# EAGLE schematic nobrain_v0.2 (EAGLE 4.16)
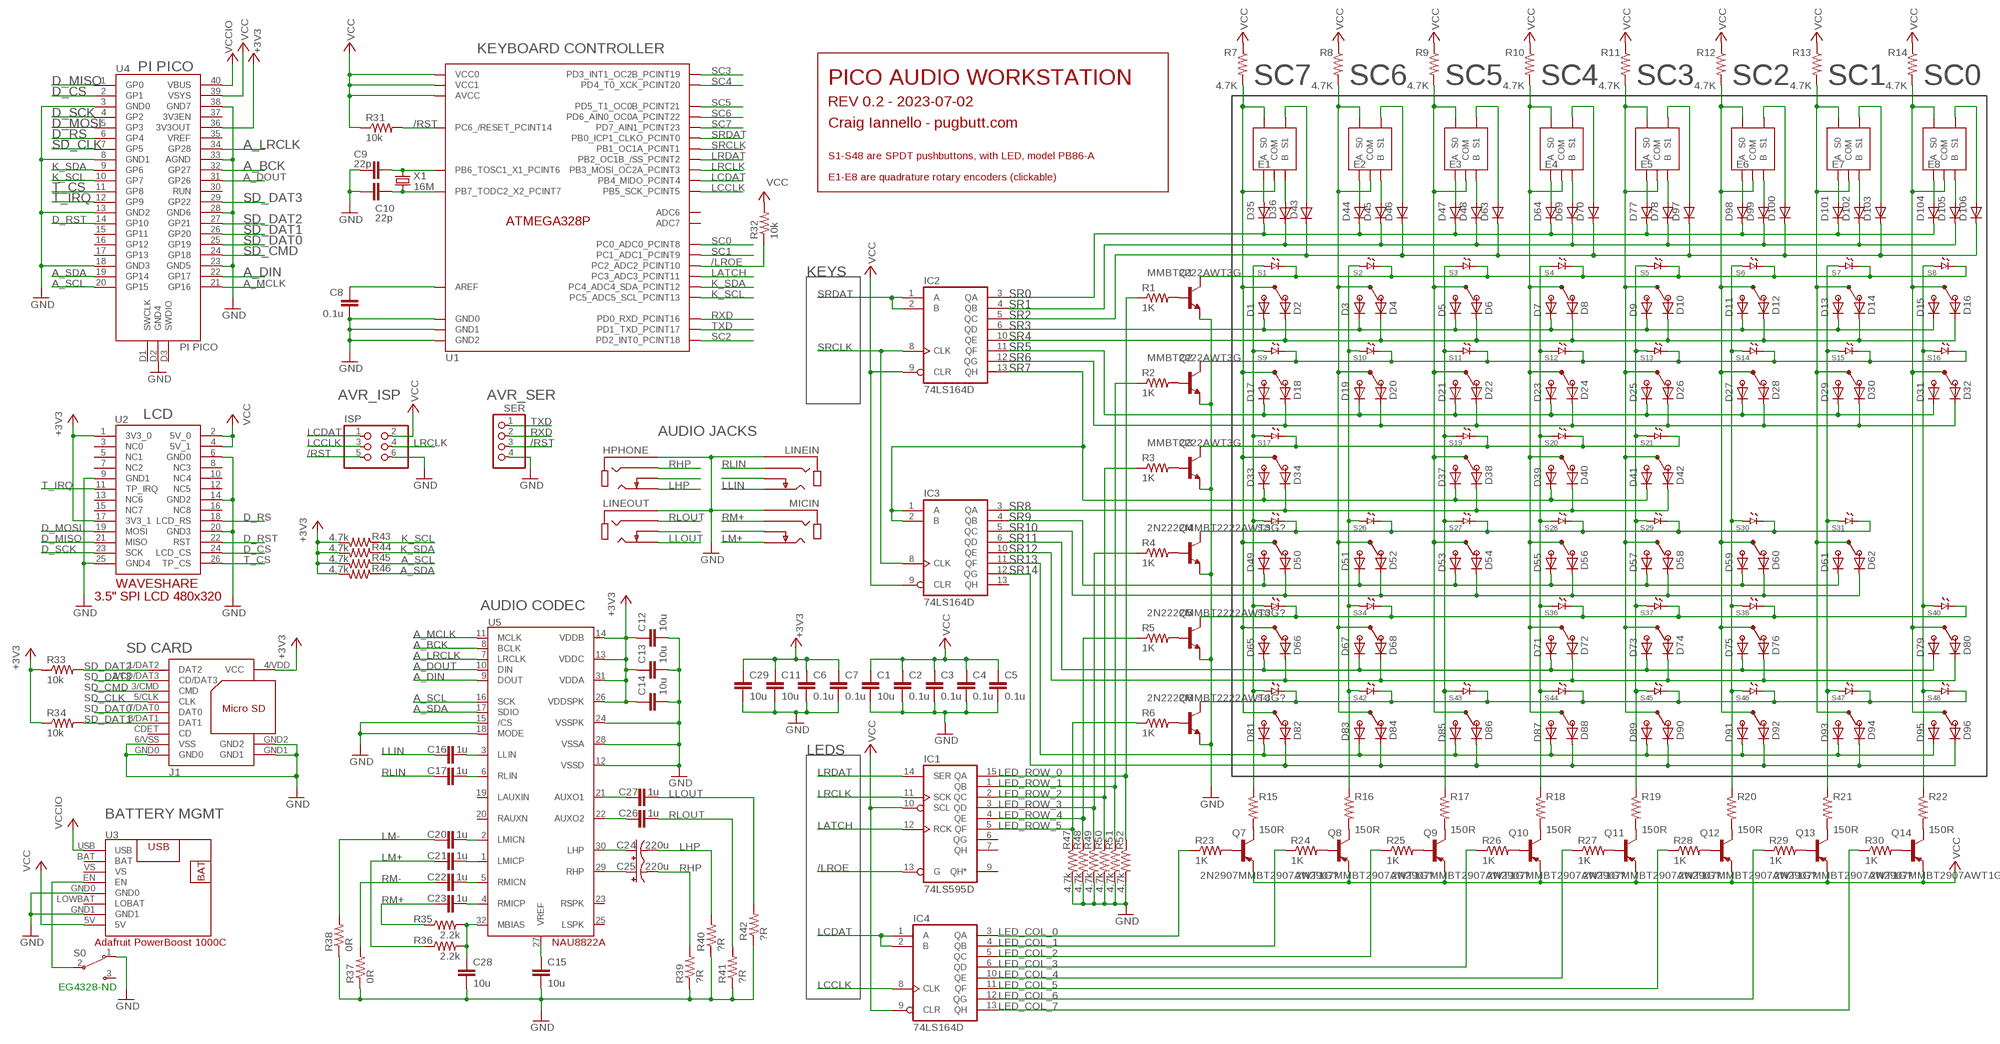
[diagram p0: schematic, sheet 1]

## Parts
C1  10u  C-EU_0805  [0805]
C2  0.1u  C-EU_0603  [0603]
C3  0.1u  C-EU_0603  [0603]
C4  0.1u  C-EU_0603  [0603]
C5  0.1u  C-EU_0603  [0603]
C6  0.1u  C-EU_0603  [0603]
C7  0.1u  C-EU_0603  [0603]
C8  0.1u  C-EU_0603  [0603]
C9  22p  C-EU_0603  [0603]
C10  22p  C-EU_0603  [0603]
C11  10u  C-EU_0805  [0805]
C12  10u  C-EU_0805  [0805]
C13  10u  C-EU_0805  [0805]
C14  10u  C-EU_0805  [0805]
C15  10u  C-EU_0805  [0805]
C16  1u  C-EU_0603  [0603]
C17  1u  C-EU_0603  [0603]
C20  1u  C-EU_0603  [0603]
C21  1u  C-EU_0603  [0603]
C22  1u  C-EU_0603  [0603]
C23  1u  C-EU_0603  [0603]
C24  220u  CPOL-US150CLZ-0810  [150CLZ-0810]
C25  220u  CPOL-US150CLZ-0810  [150CLZ-0810]
C26  1u  C-EU_0603  [0603]
C27  1u  C-EU_0603  [0603]
C28  10u  C-EU_0805  [0805]
C29  10u  C-EU_0805  [0805]
D1  DIODE-SOD323-R  [SOD323-R]
D2  DIODE-SOD323-R  [SOD323-R]
D3  DIODE-SOD323-R  [SOD323-R]
D4  DIODE-SOD323-R  [SOD323-R]
D5  DIODE-SOD323-R  [SOD323-R]
D6  DIODE-SOD323-R  [SOD323-R]
D7  DIODE-SOD323-R  [SOD323-R]
D8  DIODE-SOD323-R  [SOD323-R]
D9  DIODE-SOD323-R  [SOD323-R]
D10  DIODE-SOD323-R  [SOD323-R]
D11  DIODE-SOD323-R  [SOD323-R]
D12  DIODE-SOD323-R  [SOD323-R]
D13  DIODE-SOD323-R  [SOD323-R]
D14  DIODE-SOD323-R  [SOD323-R]
D15  DIODE-SOD323-R  [SOD323-R]
D16  DIODE-SOD323-R  [SOD323-R]
D17  DIODE-SOD323-R  [SOD323-R]
D18  DIODE-SOD323-R  [SOD323-R]
D19  DIODE-SOD323-R  [SOD323-R]
D20  DIODE-SOD323-R  [SOD323-R]
D21  DIODE-SOD323-R  [SOD323-R]
D22  DIODE-SOD323-R  [SOD323-R]
D23  DIODE-SOD323-R  [SOD323-R]
D24  DIODE-SOD323-R  [SOD323-R]
D25  DIODE-SOD323-R  [SOD323-R]
D26  DIODE-SOD323-R  [SOD323-R]
D27  DIODE-SOD323-R  [SOD323-R]
D28  DIODE-SOD323-R  [SOD323-R]
D29  DIODE-SOD323-R  [SOD323-R]
D30  DIODE-SOD323-R  [SOD323-R]
D31  DIODE-SOD323-R  [SOD323-R]
D32  DIODE-SOD323-R  [SOD323-R]
D33  DIODE-SOD323-R  [SOD323-R]
D34  DIODE-SOD323-R  [SOD323-R]
D35  DIODE-SOD323-R  [SOD323-R]
D36  DIODE-SOD323-R  [SOD323-R]
D37  DIODE-SOD323-R  [SOD323-R]
D38  DIODE-SOD323-R  [SOD323-R]
D39  DIODE-SOD323-R  [SOD323-R]
D40  DIODE-SOD323-R  [SOD323-R]
D41  DIODE-SOD323-R  [SOD323-R]
D42  DIODE-SOD323-R  [SOD323-R]
D43  DIODE-SOD323-R  [SOD323-R]
D44  DIODE-SOD323-R  [SOD323-R]
D45  DIODE-SOD323-R  [SOD323-R]
D46  DIODE-SOD323-R  [SOD323-R]
D47  DIODE-SOD323-R  [SOD323-R]
D48  DIODE-SOD323-R  [SOD323-R]
D49  DIODE-SOD323-R  [SOD323-R]
D50  DIODE-SOD323-R  [SOD323-R]
D51  DIODE-SOD323-R  [SOD323-R]
D52  DIODE-SOD323-R  [SOD323-R]
D53  DIODE-SOD323-R  [SOD323-R]
D54  DIODE-SOD323-R  [SOD323-R]
D55  DIODE-SOD323-R  [SOD323-R]
D56  DIODE-SOD323-R  [SOD323-R]
D57  DIODE-SOD323-R  [SOD323-R]
D58  DIODE-SOD323-R  [SOD323-R]
D59  DIODE-SOD323-R  [SOD323-R]
D60  DIODE-SOD323-R  [SOD323-R]
D61  DIODE-SOD323-R  [SOD323-R]
D62  DIODE-SOD323-R  [SOD323-R]
D63  DIODE-SOD323-R  [SOD323-R]
D64  DIODE-SOD323-R  [SOD323-R]
D65  DIODE-SOD323-R  [SOD323-R]
D66  DIODE-SOD323-R  [SOD323-R]
D67  DIODE-SOD323-R  [SOD323-R]
D68  DIODE-SOD323-R  [SOD323-R]
D69  DIODE-SOD323-R  [SOD323-R]
D70  DIODE-SOD323-R  [SOD323-R]
D71  DIODE-SOD323-R  [SOD323-R]
D72  DIODE-SOD323-R  [SOD323-R]
D73  DIODE-SOD323-R  [SOD323-R]
D74  DIODE-SOD323-R  [SOD323-R]
D75  DIODE-SOD323-R  [SOD323-R]
D76  DIODE-SOD323-R  [SOD323-R]
D77  DIODE-SOD323-R  [SOD323-R]
D78  DIODE-SOD323-R  [SOD323-R]
D79  DIODE-SOD323-R  [SOD323-R]
D80  DIODE-SOD323-R  [SOD323-R]
D81  DIODE-SOD323-R  [SOD323-R]
D82  DIODE-SOD323-R  [SOD323-R]
D83  DIODE-SOD323-R  [SOD323-R]
D84  DIODE-SOD323-R  [SOD323-R]
D85  DIODE-SOD323-R  [SOD323-R]
D86  DIODE-SOD323-R  [SOD323-R]
D87  DIODE-SOD323-R  [SOD323-R]
D88  DIODE-SOD323-R  [SOD323-R]
D89  DIODE-SOD323-R  [SOD323-R]
D90  DIODE-SOD323-R  [SOD323-R]
D91  DIODE-SOD323-R  [SOD323-R]
D92  DIODE-SOD323-R  [SOD323-R]
D93  DIODE-SOD323-R  [SOD323-R]
D94  DIODE-SOD323-R  [SOD323-R]
D95  DIODE-SOD323-R  [SOD323-R]
D96  DIODE-SOD323-R  [SOD323-R]
D97  DIODE-SOD323-R  [SOD323-R]
D98  DIODE-SOD323-R  [SOD323-R]
D99  DIODE-SOD323-R  [SOD323-R]
D100  DIODE-SOD323-R  [SOD323-R]
D101  DIODE-SOD323-R  [SOD323-R]
D102  DIODE-SOD323-R  [SOD323-R]
D103  DIODE-SOD323-R  [SOD323-R]
D104  DIODE-SOD323-R  [SOD323-R]
D105  DIODE-SOD323-R  [SOD323-R]
D106  DIODE-SOD323-R  [SOD323-R]
E1  ENCODER_BOURNS_PEC12R-3225F-S0024  [ENCODER_BOURNS_PEC12R-3225F-S0024]
E2  ENCODER_BOURNS_PEC12R-3225F-S0024  [ENCODER_BOURNS_PEC12R-3225F-S0024]
E3  ENCODER_BOURNS_PEC12R-3225F-S0024  [ENCODER_BOURNS_PEC12R-3225F-S0024]
E4  ENCODER_BOURNS_PEC12R-3225F-S0024  [ENCODER_BOURNS_PEC12R-3225F-S0024]
E5  ENCODER_BOURNS_PEC12R-3225F-S0024  [ENCODER_BOURNS_PEC12R-3225F-S0024]
E6  ENCODER_BOURNS_PEC12R-3225F-S0024  [ENCODER_BOURNS_PEC12R-3225F-S0024]
E7  ENCODER_BOURNS_PEC12R-3225F-S0024  [ENCODER_BOURNS_PEC12R-3225F-S0024]
E8  ENCODER_BOURNS_PEC12R-3225F-S0024  [ENCODER_BOURNS_PEC12R-3225F-S0024]
HPHONE  HPHONE_SWITCH_SJ-3524-SMT-TR_  [HPHONE_CUI_SJ-3524-SMT-TR]
IC1  74LS595D  [SO16]
IC2  74LS164D  [SO14]
IC3  74LS164D  [SO14]
IC4  74LS164D  [SO14]
ISP  PINHD-2X3  [2X03]
J1  MICROSD_AMPHENOL_GTFP084328  [MICROSD_AMPHENOL_GTFP08432B1HR]
LINEIN  HPHONE_SWITCH_SJ-3524-SMT-TR_  [HPHONE_CUI_SJ-3524-SMT-TR]
LINEOUT  HPHONE_SWITCH_SJ-3524-SMT-TR_  [HPHONE_CUI_SJ-3524-SMT-TR]
MICIN  HPHONE_SWITCH_SJ-3524-SMT-TR_  [HPHONE_CUI_SJ-3524-SMT-TR]
Q1  MMBT2222AWT3G  2N2222MMBT2222AWT3G?  [SC-70-3_SOT-323]
Q2  MMBT2222AWT3G  2N2222MMBT2222AWT3G?  [SC-70-3_SOT-323]
Q3  MMBT2222AWT3G  2N2222MMBT2222AWT3G?  [SC-70-3_SOT-323]
Q4  2N2222MMBT2222AWT3G?  [SC-70-3_SOT-323]
Q5  2N2222MMBT2222AWT3G?  [SC-70-3_SOT-323]
Q6  2N2222MMBT2222AWT3G?  [SC-70-3_SOT-323]
Q7  2N2907MMBT2907AWT1G?  [SC-70-3_SOT-323]
Q8  2N2907MMBT2907AWT1G?  [SC-70-3_SOT-323]
Q9  2N2907MMBT2907AWT1G?  [SC-70-3_SOT-323]
Q10  2N2907MMBT2907AWT1G?  [SC-70-3_SOT-323]
Q11  2N2907MMBT2907AWT1G?  [SC-70-3_SOT-323]
Q12  2N2907MMBT2907AWT1G?  [SC-70-3_SOT-323]
Q13  2N2907MMBT2907AWT1G?  [SC-70-3_SOT-323]
Q14  2N2907MMBT2907AWT1G?  [SC-70-3_SOT-323]
R1  1K  R-US0603  [0603]
R2  1K  R-US0603  [0603]
R3  1K  R-US0603  [0603]
R4  1K  R-US0603  [0603]
R5  1K  R-US0603  [0603]
R6  1K  R-US0603  [0603]
R7  4.7K  R-US0603  [0603]
R8  4.7K  R-US0603  [0603]
R9  4.7K  R-US0603  [0603]
R10  4.7K  R-US0603  [0603]
R11  4.7K  R-US0603  [0603]
R12  4.7K  R-US0603  [0603]
R13  4.7K  R-US0603  [0603]
R14  4.7K  R-US0603  [0603]
R15  150R  R-US0603  [0603]
R16  150R  R-US0603  [0603]
R17  150R  R-US0603  [0603]
R18  150R  R-US0603  [0603]
R19  150R  R-US0603  [0603]
R20  150R  R-US0603  [0603]
R21  150R  R-US0603  [0603]
R22  150R  R-US0603  [0603]
R23  1K  R-US0603  [0603]
R24  1K  R-US0603  [0603]
R25  1K  R-US0603  [0603]
R26  1K  R-US0603  [0603]
R27  1K  R-US0603  [0603]
R28  1K  R-US0603  [0603]
R29  1K  R-US0603  [0603]
R30  1K  R-US0603  [0603]
R31  10k  R-US0603  [0603]
R32  10k  R-US0603  [0603]
R33  10k  R-US0603  [0603]
R34  10k  R-US0603  [0603]
R35  2.2k  R-US0603  [0603]
R36  2.2k  R-US0603  [0603]
R37  0R  R-US0603  [0603]
R38  0R  R-US0603  [0603]
R39  ?R  R-US0603  [0603]
R40  ?R  R-US0603  [0603]
R41  ?R  R-US0603  [0603]
R42  ?R  R-US0603  [0603]
R43  4.7k  R-US0603  [0603]
R44  4.7k  R-US0603  [0603]
R45  4.7k  R-US0603  [0603]
R46  4.7k  R-US0603  [0603]
R47  4.7k  R-US0603  [0603]
R48  4.7k  R-US0603  [0603]
R49  4.7k  R-US0603  [0603]
R50  4.7k  R-US0603  [0603]
R51  4.7k  R-US0603  [0603]
R52  4.7k  R-US0603  [0603]
S0  ROCKEREG4328-ND  [ROCKER_SPDT_EG4328-ND]
S1  PB8601-A1  [PAD_PB86-A1]
S2  PB8601-A1  [PAD_PB86-A1]
S3  PB8601-A1  [PAD_PB86-A1]
S4  PB8601-A1  [PAD_PB86-A1]
S5  PB8601-A1  [PAD_PB86-A1]
S6  PB8601-A1  [PAD_PB86-A1]
S7  PB8601-A1  [PAD_PB86-A1]
S8  PB8601-A1  [PAD_PB86-A1]
S9  PB8601-A1  [PAD_PB86-A1]
S10  PB8601-A1  [PAD_PB86-A1]
S11  PB8601-A1  [PAD_PB86-A1]
S12  PB8601-A1  [PAD_PB86-A1]
S13  PB8601-A1  [PAD_PB86-A1]
S14  PB8601-A1  [PAD_PB86-A1]
S15  PB8601-A1  [PAD_PB86-A1]
S16  PB8601-A1  [PAD_PB86-A1]
S17  PB8601-A1  [PAD_PB86-A1]
S19  PB8601-A1  [PAD_PB86-A1]
S20  PB8601-A1  [PAD_PB86-A1]
S21  PB8601-A1  [PAD_PB86-A1]
S25  PB8601-A1  [PAD_PB86-A1]
S26  PB8601-A1  [PAD_PB86-A1]
S27  PB8601-A1  [PAD_PB86-A1]
S28  PB8601-A1  [PAD_PB86-A1]
S29  PB8601-A1  [PAD_PB86-A1]
S30  PB8601-A1  [PAD_PB86-A1]
S31  PB8601-A1  [PAD_PB86-A1]
S33  PB8601-A1  [PAD_PB86-A1]
S34  PB8601-A1  [PAD_PB86-A1]
S36  PB8601-A1  [PAD_PB86-A1]
S37  PB8601-A1  [PAD_PB86-A1]
S38  PB8601-A1  [PAD_PB86-A1]
S40  PB8601-A1  [PAD_PB86-A1]
S41  PB8601-A1  [PAD_PB86-A1]
S42  PB8601-A1  [PAD_PB86-A1]
S43  PB8601-A1  [PAD_PB86-A1]
S44  PB8601-A1  [PAD_PB86-A1]
S45  PB8601-A1  [PAD_PB86-A1]
S46  PB8601-A1  [PAD_PB86-A1]
S47  PB8601-A1  [PAD_PB86-A1]
S48  PB8601-A1  [PAD_PB86-A1]
SER  PINHD-1X4  [1X04]
U1  ATMEGA238PTQFP_  [TQFP32-08]
U2  LCD_SPI_3.5_WAVESHARE_480X320  [WAVESHARE_SPI_3.5_480X320]
U3  ADAFRUIT_POWERBOOST_1000C  [ADAFRUIT_POWERBOOST_1000C]
U4  PI_PICO  [PI_PICO]
U5  AUDIO_CODEC_I2S_SPI_NAU88C22YG_NAU88C22YG-ND  [QFN32]
X1  16M  CRYSTALHC49S  [HC49/S]

## Nets
+3V3 [mid_power]: C6.1 C7.1 C11.1 C12.1 C13.1 C14.1 C29.1 J1.4/VDD(VCC) R33.1 R34.1 R43.2 R44.2 R45.2 R46.2 U2.1(3V3_0) U2.17(3V3_1) U4.36(3V3OUT) U5.13(VDDC) U5.14(VDDB) U5.26(VDDSPK) U5.31(VDDA)
/LROE: IC1.13(G) R32.1 U1.25(PC2_ADC2_PCINT10)
/RST: ISP.5 R31.2 SER.3 U1.29(PC6_/RESET_PCINT14)
A_BCK: U4.32(GP27) U5.8(BCLK)
A_DIN: U4.22(GP17) U5.9(DOUT)
A_DOUT: U4.31(GP26) U5.10(DIN)
A_LRCLK: U4.34(GP28) U5.7(LRCLK)
A_MCLK: U4.21(GP16) U5.11(MCLK)
A_SCL: R45.1 U4.20(GP15) U5.16(SCK)
A_SDA: R46.1 U4.19(GP14) U5.17(SDIO)
D_CS: U2.24(LCD_CS) U4.2(GP1)
D_MISO: U2.21(MISO) U4.1(GP0)
D_MOSI: U2.19(MOSI) U4.5(GP3)
D_RS: U2.18(LCD_RS) U4.6(GP4)
D_RST: U2.22(RST) U4.14(GP10)
D_SCK: U2.23(SCK) U4.4(GP2)
GND [mid_power]: C1.2 C2.2 C3.2 C4.2 C5.2 C6.2 C7.2 C8.2 C9.1 C10.1 C11.2 C12.2 C13.2 C14.2 C15.2 C28.2 C29.2 HPHONE.SLEEVE ISP.6 J1.6/VSS(VSS) J1.GND0 J1.GND1 J1.GND2 LINEIN.SLEEVE LINEOUT.SLEEVE MICIN.SLEEVE Q1.2(E) Q2.2(E) Q3.2(E) Q4.2(E) Q5.2(E) Q6.2(E) R37.1 R38.1 R39.1 R40.1 R41.1 R42.1 R47.2 R48.2 R49.2 R50.2 R51.2 R52.2 S0.1 SER.4 U1.3(GND0) U1.5(GND1) U1.21(GND2) U2.6(GND0) U2.9(GND1) U2.14(GND2) U2.20(GND3) U2.25(GND4) U3.GND0 U3.GND1 U4.3(GND0) U4.8(GND1) U4.13(GND2) U4.18(GND3) U4.23(GND5) U4.28(GND6) U4.33(AGND) U4.38(GND7) U4.D2(GND4) U5.12(VSSD) U5.15(/CS) U5.18(MODE) U5.24(VSSPK) U5.28(VSSA)
K_SCL: R43.1 U1.28(PC5_ADC5_SCL_PCINT13) U4.10(GP7)
K_SDA: R44.1 U1.27(PC4_ADC4_SDA_PCINT12) U4.9(GP6)
LATCH: IC1.12(RCK) U1.26(PC3_ADC3_PCINT11)
LC1: IC4.4(QB) R24.1
LC2: IC4.5(QC) R25.1
LC3: IC4.6(QD) R26.1
LC4: IC4.10(QE) R27.1
LC5: IC4.11(QF) R28.1
LC6: IC4.12(QG) R29.1
LC7: IC4.13(QH) R30.1
LCCLK: IC4.8(CLK) ISP.3 U1.17(PB5_SCK_PCINT5)
LCDAT: IC4.1(A) IC4.2(B) ISP.1 U1.16(PB4_MIDO_PCINT4)
LHP: C24.- HPHONE.TIP R40.2
LLIN: C16.1 LINEIN.TIP
LLOUT: C27.2 LINEOUT.TIP R42.2
LM+: C21.1 MICIN.TIP R36.1
LM- [mid_power]: C20.1 R38.2
LRCLK: IC1.11(SCK) ISP.4 U1.15(PB3_MOSI_OC2A_PCINT3)
LRDAT: IC1.14(SER) U1.14(PB2_OC1B_/SS_PCINT2)
N$1: Q1.3(C) S1.K S2.K S3.K S4.K S5.K S6.K S7.K S8.K
N$2: D35.C D44.C D47.C D64.C D77.C D98.C D101.C D104.C IC2.3(QA)
N$3: D36.C D45.C D48.C D69.C D78.C D99.C D102.C D105.C IC2.4(QB)
N$4: D1.C D3.C D5.C D7.C D9.C D11.C D13.C D15.C IC2.6(QD)
N$5: D1.A S1.NO
N$6: D2.A S1.NC
N$7: D2.C D4.C D6.C D8.C D10.C D12.C D14.C D16.C IC2.10(QE)
N$9: D3.A S2.NO
N$10: D43.C D46.C D63.C D70.C D97.C D100.C D103.C D106.C IC2.5(QC)
N$11: D4.A S2.NC
N$12: D43.A E1.SW1(S1)
N$13: D35.A E1.A
N$14: Q2.3(C) S9.K S10.K S11.K S12.K S13.K S14.K S15.K S16.K
N$15: D36.A E1.B
N$16: D63.A E3.SW1(S1)
N$17: D46.A E2.SW1(S1)
N$18: D70.A E4.SW1(S1)
N$19: D97.A E5.SW1(S1)
N$20: D17.A S9.NO
N$21: D100.A E6.SW1(S1)
N$22: D103.A E7.SW1(S1)
N$23: D18.A S9.NC
N$24: D106.A E8.SW1(S1)
N$25: D44.A E2.A
N$26: Q7.3(C) R15.2
N$27: D45.A E2.B
N$28: D47.A E3.A
N$29: D17.C D19.C D21.C D23.C D25.C D27.C D29.C D31.C IC2.11(QF)
N$30: D5.A S3.NO
N$31: D6.A S3.NC
N$32: D7.A S4.NO
N$33: D8.A S4.NC
N$34: D9.A S5.NO
N$35: D10.A S5.NC
N$36: D11.A S6.NO
N$37: D12.A S6.NC
N$38: D13.A S7.NO
N$39: D14.A S7.NC
N$40: D15.A S8.NO
N$41: D16.A S8.NC
N$42: D18.C D20.C D22.C D24.C D26.C D28.C D30.C D32.C IC2.12(QG)
N$43: Q1.1(B) R1.2
N$44: D48.A E3.B
N$45: D19.A S10.NO
N$46: D20.A S10.NC
N$47: D64.A E4.A
N$48: Q3.1(B) R3.2
N$49: D69.A E4.B
N$50: D77.A E5.A
N$51: Q4.1(B) R4.2
N$52: D78.A E5.B
N$53: D98.A E6.A
N$54: Q5.1(B) R5.2
N$55: D99.A E6.B
N$56: D101.A E7.A
N$57: Q6.1(B) R6.2
N$58: D102.A E7.B
N$59: D21.A S11.NO
N$60: D22.A S11.NC
N$61: D23.A S12.NO
N$62: D24.A S12.NC
N$63: D25.A S13.NO
N$64: D26.A S13.NC
N$65: D27.A S14.NO
N$66: D28.A S14.NC
N$67: D29.A S15.NO
N$68: D30.A S15.NC
N$69: D31.A S16.NO
N$70: D32.A S16.NC
N$71: Q3.3(C) S17.K S19.K S20.K S21.K
N$72: D104.A E8.A
N$73: D33.A S17.NO
N$74: D34.A S17.NC
N$75: Q2.1(B) R2.2
N$77: D34.C D38.C D40.C D42.C IC3.3(QA)
N$78: D105.A E8.B
N$80: C8.1 U1.20(AREF)
N$81: C10.2 U1.8(PB7_TODC2_X2_PCINT7) X1.2
N$82: C9.2 U1.7(PB6_TOSC1_X1_PCINT6) X1.1
N$83: S0.2 U3.EN
N$84: C15.1 U5.27(VREF)
N$85: IC1.15(QA) R1.1 R52.1
N$86: IC1.1(QB) R2.1 R51.1
N$87: IC1.2(QC) R3.1 R50.1
N$88: IC1.3(QD) R4.1 R49.1
N$89: IC1.4(QE) R5.1 R48.1
N$90: IC1.5(QF) R6.1 R47.1
N$91: Q8.3(C) R16.2
N$92: Q9.3(C) R17.2
N$93: Q10.3(C) R18.2
N$94: D37.A S19.NO
N$95: D38.A S19.NC
N$96: D39.A S20.NO
N$97: D40.A S20.NC
N$98: D41.A S21.NO
N$99: D42.A S21.NC
N$100: Q11.3(C) R19.2
N$101: Q12.3(C) R20.2
N$102: Q13.3(C) R21.2
N$103: Q14.3(C) R22.2
N$104: Q7.1(B) R23.2
N$105: Q8.1(B) R24.2
N$106: Q4.3(C) S25.K S26.K S27.K S28.K S29.K S30.K S31.K
N$107: D49.A S25.NO
N$108: D50.A S25.NC
N$109: Q9.1(B) R25.2
N$110: D49.C D51.C D53.C D55.C D57.C D59.C D61.C IC3.4(QB)
N$111: D50.C D52.C D54.C D56.C D58.C D60.C D62.C IC3.5(QC)
N$112: C16.2 U5.3(LLIN)
N$113: D51.A S26.NO
N$114: D52.A S26.NC
N$115: C17.2 U5.6(RLIN)
N$121: D53.A S27.NO
N$122: D54.A S27.NC
N$123: D55.A S28.NO
N$124: D56.A S28.NC
N$125: D57.A S29.NO
N$126: D58.A S29.NC
N$127: D59.A S30.NO
N$128: D60.A S30.NC
N$129: D61.A S31.NO
N$130: D62.A S31.NC
N$131: Q10.1(B) R26.2
N$132: Q11.1(B) R27.2
N$133: Q5.3(C) S33.K S34.K S36.K S37.K S38.K S40.K
N$134: D65.A S33.NO
N$135: D66.A S33.NC
N$136: D65.C D67.C D71.C D73.C D75.C D79.C IC3.6(QD)
N$137: D66.C D68.C D72.C D74.C D76.C D80.C IC3.10(QE)
N$138: D67.A S34.NO
N$139: D68.A S34.NC
N$140: Q12.1(B) R28.2
N$141: Q13.1(B) R29.2
N$142: D71.A S36.NO
N$143: D72.A S36.NC
N$144: D73.A S37.NO
N$145: D74.A S37.NC
N$146: D75.A S38.NO
N$147: D76.A S38.NC
N$148: Q14.1(B) R30.2
N$149: IC4.3(QA) R23.1
N$150: D79.A S40.NO
N$151: D80.A S40.NC
N$152: Q6.3(C) S41.K S42.K S43.K S44.K S45.K S46.K S47.K S48.K
N$153: R15.1 S1.A S9.A S17.A S25.A S33.A S41.A
N$154: D81.A S41.NO
N$155: D82.A S41.NC
N$156: D81.C D83.C D85.C D87.C D89.C D91.C D93.C D95.C IC3.11(QF)
N$157: D82.C D84.C D86.C D88.C D90.C D92.C D94.C D96.C IC3.12(QG)
N$158: R16.1 S2.A S10.A S26.A S34.A S42.A
N$159: D83.A S42.NO
N$160: D84.A S42.NC
N$161: R17.1 S3.A S11.A S19.A S27.A S43.A
N$162: R18.1 S4.A S12.A S20.A S28.A S36.A S44.A
N$163: R19.1 S5.A S13.A S21.A S29.A S37.A S45.A
N$164: R20.1 S6.A S14.A S30.A S38.A S46.A
N$165: R21.1 S7.A S15.A S31.A S47.A
N$166: R22.1 S8.A S16.A S40.A S48.A
N$167: D85.A S43.NO
N$168: D86.A S43.NC
N$169: D87.A S44.NO
N$170: D88.A S44.NC
N$171: D89.A S45.NO
N$172: D90.A S45.NC
N$173: D91.A S46.NO
N$174: D92.A S46.NC
N$175: D93.A S47.NO
N$176: D94.A S47.NC
N$177: D95.A S48.NO
N$178: D96.A S48.NC
N$179: HPHONE.SWITCH(SW)
N$180: D33.C D37.C D39.C D41.C IC2.13(QH) IC3.1(A) IC3.2(B)
N$183: LINEOUT.SWITCH(SW)
N$187: LINEIN.SWITCH(SW)
N$191: MICIN.SWITCH(SW)
N$193: C20.2 U5.2(LMICN)
N$194: C21.2 U5.1(LMICP)
N$195: C22.2 U5.5(RMICN)
N$196: C23.2 U5.4(RMICP)
N$197: C25.+ U5.29(RHP)
N$198: C24.+ U5.30(LHP)
N$199: C26.1 U5.22(AUXO2)
N$200: C27.1 U5.21(AUXO1)
N$201: C28.1 R35.2 R36.2 U5.32(MBIAS)
RHP: C25.- HPHONE.RING R39.2
RLIN: C17.1 LINEIN.RING
RLOUT: C26.2 LINEOUT.RING R41.2
RM+: C23.1 MICIN.RING R35.1
RM- [mid_power]: C22.1 R37.2
RXD: SER.2 U1.30(PD0_RXD_PCINT16)
SC0: E8.COM E8.SW0(S0) R14.2 S8.COM0(COM) S16.COM0(COM) S40.COM0(COM) S48.COM0(COM) U1.23(PC0_ADC0_PCINT8)
SC1: E7.COM E7.SW0(S0) R13.2 S7.COM0(COM) S15.COM0(COM) S31.COM0(COM) S47.COM0(COM) U1.24(PC1_ADC1_PCINT9)
SC2: E6.COM E6.SW0(S0) R12.2 S6.COM0(COM) S14.COM0(COM) S30.COM0(COM) S38.COM0(COM) S46.COM0(COM) U1.32(PD2_INT0_PCINT18)
SC3: E5.COM E5.SW0(S0) R11.2 S5.COM0(COM) S13.COM0(COM) S21.COM0(COM) S29.COM0(COM) S37.COM0(COM) S45.COM0(COM) U1.1(PD3_INT1_OC2B_PCINT19)
SC4: E4.COM E4.SW0(S0) R10.2 S4.COM0(COM) S12.COM0(COM) S20.COM0(COM) S28.COM0(COM) S36.COM0(COM) S44.COM0(COM) U1.2(PD4_T0_XCK_PCINT20)
SC5: E3.COM E3.SW0(S0) R9.2 S3.COM0(COM) S11.COM0(COM) S19.COM0(COM) S27.COM0(COM) S43.COM0(COM) U1.9(PD5_T1_OC0B_PCINT21)
SC6: E2.COM E2.SW0(S0) R8.2 S2.COM0(COM) S10.COM0(COM) S26.COM0(COM) S34.COM0(COM) S42.COM0(COM) U1.10(PD6_AIN0_OC0A_PCINT22)
SC7: E1.COM E1.SW0(S0) R7.2 S1.COM0(COM) S9.COM0(COM) S17.COM0(COM) S25.COM0(COM) S33.COM0(COM) S41.COM0(COM) U1.11(PD7_AIN1_PCINT23)
SD_CLK: J1.5/CLK(CLK) U4.7(GP5)
SD_CMD: J1.3/CMD(CMD) U4.24(GP18)
SD_DAT0: J1.7/DAT0(DAT0) U4.25(GP19)
SD_DAT1: J1.8/DAT1(DAT1) R34.2 U4.26(GP20)
SD_DAT2: J1.1/DAT2(DAT2) R33.2 U4.27(GP21)
SD_DAT3: J1.2/CD/DAT3(CD/DAT3) U4.29(GP22)
SRCLK: IC2.8(CLK) IC3.8(CLK) U1.13(PB1_OC1A_PCINT1)
SRDAT: IC2.1(A) IC2.2(B) U1.12(PB0_ICP1_CLKO_PCINT0)
T_CS: U2.26(TP_CS) U4.11(GP8)
T_IRQ: U2.11(TP_IRQ) U4.12(GP9)
TXD: SER.1 U1.31(PD1_TXD_PCINT17)
VCC [mid_power]: C1.1 C2.1 C3.1 C4.1 C5.1 IC1.10(SCL) IC2.9(CLR) IC3.9(CLR) IC4.9(CLR) ISP.2 Q7.2(E) Q8.2(E) Q9.2(E) Q10.2(E) Q11.2(E) Q12.2(E) Q13.2(E) Q14.2(E) R7.1 R8.1 R9.1 R10.1 R11.1 R12.1 R13.1 R14.1 R31.1 R32.2 U1.4(VCC0) U1.6(VCC1) U1.18(AVCC) U2.2(5V_0) U2.4(5V_1) U3.5V U4.39(VSYS)
VCCIO [high_power]: U3.USB U4.40(VBUS)
Unconnected: IC1.6(QG) IC1.7(QH) IC1.9(QH*) IC3.13(QH) J1.CDET(CD) S0.3 U1.19(ADC6) U1.22(ADC7) U2.3(NC0) U2.5(NC1) U2.7(NC2) U2.8(NC3) U2.10(NC4) U2.12(NC5) U2.13(NC6) U2.15(NC7) U2.16(NC8) U3.BAT U3.LOWBAT(LOBAT) U3.VS U4.15(GP11) U4.16(GP12) U4.17(GP13) U4.30(RUN) U4.35(VREF) U4.37(3V3EN) U4.D1(SWCLK) U4.D3(SWDIO) U5.19(LAUXIN) U5.20(RAUXN) U5.23(RSPK) U5.25(LSPK)

## Notes on the sheet
- KEYBOARD CONTROLLER
- PI PICO
- PICO AUDIO WORKSTATION | SC7 | SC6 | SC5 | SC4 | SC3 | SC2 | SC1 | SC0
- REV 0.2 - 2023-07-02
- Craig Iannello - pugbutt.com
- S1-S48 are SPDT pushbuttons, with LED, model PB86-A
- E1-E8 are quadrature rotary encoders (clickable)
- ATMEGA328P
- KEYS
- SR0
- SR1
- SR2
- SR3
- SR4
- SR5
- SR6
- SR7
- AVR_ISP | AVR_SER
- LCD
- AUDIO JACKS
- SR8
- SR9
- SR10
- SR11
- SR12
- SR13
- SR14
- AUDIO CODEC
- SD CARD
- LEDS
- LED_ROW_0
- LED_ROW_1
- LED_ROW_2
- LED_ROW_3
- BATTERY MGMT | LED_ROW_4
- LED_ROW_5
- LED_COL_0
- LED_COL_1
- LED_COL_2
- LED_COL_3
- LED_COL_4
- EG4328-ND | LED_COL_5
- LED_COL_6
- LED_COL_7

## Power pins joined to a net without a drawn wire
GND: IC1.8(GND) IC2.7(GND) IC3.7(GND) IC4.7(GND)
VCC: IC1.16(VCC) IC2.14(VCC) IC3.14(VCC) IC4.14(VCC)

## Library data of the parts
C1-C17 C20-C23 C26-C29 = 01-hacker-daw:C-EU
C24 C25 = rcl:CPOL-US: POLARIZED CAPACITOR, American symbol
D1-D106 = diode:DIODE-: DIODE
E1-E8 = 01-hacker-daw:ENCODER_BOURNS_PEC12R-3225F-S0024
HPHONE LINEIN LINEOUT MICIN = 01-hacker-daw:HPHONE_SWITCH
IC1 = 74xx-us:74*595: 8-bit SHIFT REGISTER, output latch
IC2-IC4 = 74xx-us:74*164: 8-bit parallel out SHIFT REGISTER
ISP = pinhead:PINHD-2X3: PIN HEADER
J1 = 07-Retrocomputing:MICROSD_AMPHENOL_GTFP084328
Q1-Q6 = 01-hacker-daw:2N2222*: NPN Transistor
Q7-Q14 = 01-hacker-daw:2N2907*: PNP Transistor
R1-R52 = 01-hacker-daw:R-US
S0 = 06_buttons_switches:ROCKER
S1-S17 S19-S21 S25-S31 S33 S34 S36-S38 S40-S48 = 01-hacker-daw:PB8601-A1
SER = pinhead:PINHD-1X4: PIN HEADER
U1 = 02_atmel:ATMEGA238P
U2 = 01-hacker-daw:LCD_SPI_3.5_WAVESHARE_480X320
U3 = 01-hacker-daw:ADAFRUIT_POWERBOOST_1000C
U4 = 07-Retrocomputing:PI_PICO
U5 = 08-audio:AUDIO_CODEC_I2S_SPI_NAU88C22YG_NAU88C22YG-ND
X1 = crystal:CRYSTAL: CRYSTAL

## Net classes
0 default: width 0.152 mm, drill 0.152 mm, clearance 0.254 mm
1 high_power: width 0.61 mm, drill 0.33 mm, clearance 0.61 mm
2 mid_power: width 0.305 mm, drill 0.152 mm, clearance 0.305 mm